# Altium schematic sheet 主结构图.SchDoc
size A4; DocumentNumber: 1; SheetNumber: 1; SheetTotal: 3
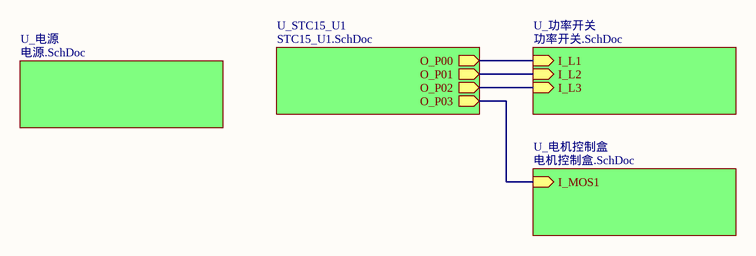
[diagram p0: 主结构图.SchDoc]

## Sub-sheets
U_STC15_U1 = STC15_U1.SchDoc: O_P00 (out), O_P01 (out), O_P02 (out), O_P03 (out)
U_功率开关 = 功率开关.SchDoc: I_L1 (in), I_L2 (in), I_L3 (in)
U_电机控制盒 = 电机控制盒.SchDoc: I_MOS1 (in)
U_电源 = 电源.SchDoc: no entries

## Nets
(unnamed): sheet U_STC15_U1/O_P00, sheet U_功率开关/I_L1
(unnamed): sheet U_STC15_U1/O_P01, sheet U_功率开关/I_L2
(unnamed): sheet U_STC15_U1/O_P02, sheet U_功率开关/I_L3
(unnamed): sheet U_STC15_U1/O_P03, sheet U_电机控制盒/I_MOS1